# EAGLE schematic untitled (EAGLE 9.6.2)
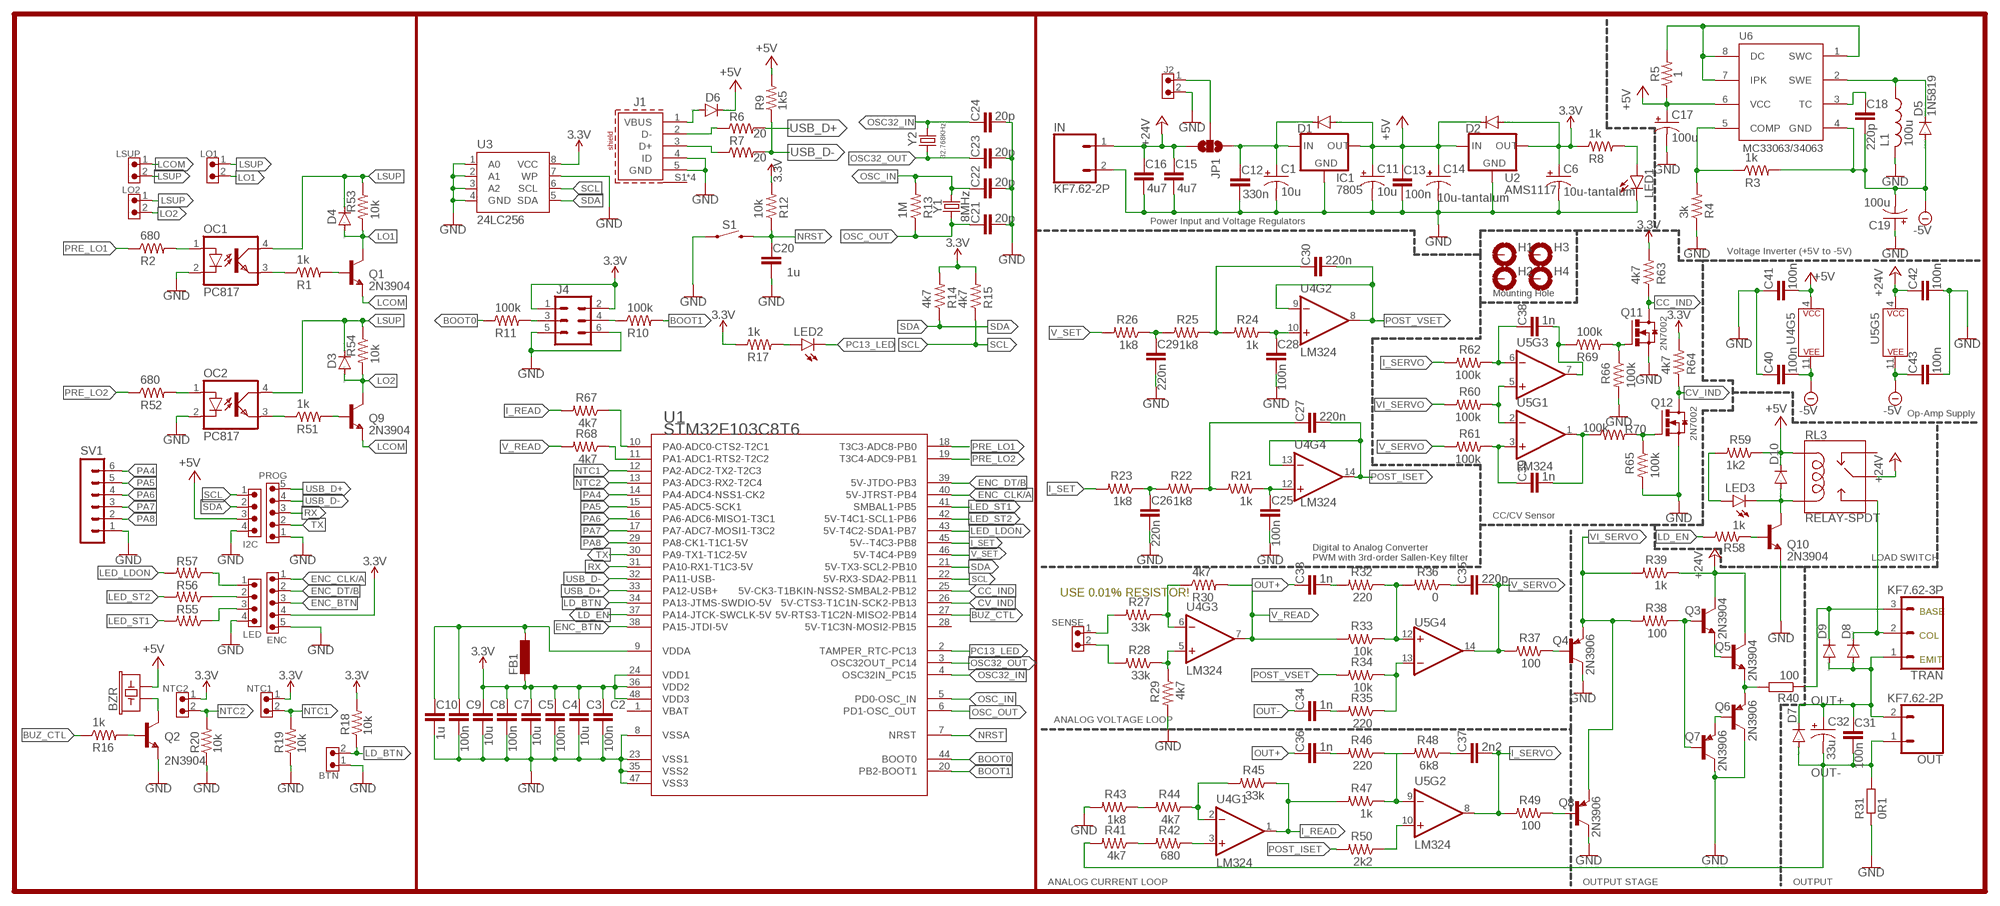
[diagram p0: schematic, sheet 1]

## Parts
BTN  61900211121  [61900211121]
BZR  BUZZER-PTH_KIT  [BUZZER-12MM-KIT]
C1  10u  CPOL-USE2.5-6  [E2,5-6]
C2  100n  C-EUC0805  [C0805]
C3  10u  C-EUC0805  [C0805]
C4  100n  C-EUC0805  [C0805]
C5  10u  C-EUC0805  [C0805]
C6  10u-tantalum  CPOL-USCT3528  [CT3528]
C7  100n  C-EUC0805  [C0805]
C8  10u  C-EUC0805  [C0805]
C9  100n  C-EUC0805  [C0805]
C10  1u  C-EUC0805  [C0805]
C11  10u  CPOL-USE2.5-6  [E2,5-6]
C12  330n  C-EUC0805  [C0805]
C13  100n  C-EUC0805  [C0805]
C14  10u-tantalum  CPOL-USCT3528  [CT3528]
C15  4u7  C-EUC0805  [C0805]
C16  4u7  C-EUC0805  [C0805]
C17  100u  CPOL-USE2.5-6  [E2,5-6]
C18  220p  C-EUC0805  [C0805]
C19  100u  CPOL-USE2.5-6  [E2,5-6]
C20  1u  C-EUC0805  [C0805]
C21  20p  C-EUC0805  [C0805]
C22  20p  C-EUC0805  [C0805]
C23  20p  C-EUC0805  [C0805]
C24  20p  C-EUC0805  [C0805]
C25  100n  C-EUC0805  [C0805]
C26  220n  C-EUC0805  [C0805]
C27  220n  C-EUC0805  [C0805]
C28  100n  C-EUC0805  [C0805]
C29  220n  C-EUC0805  [C0805]
C30  220n  C-EUC0805  [C0805]
C31  100n  C-EUC0805  [C0805]
C32  33u  CPOL-USD/7343-31R  [D/7343-31R]
C33  1n  C-EUC0805  [C0805]
C34  1n  C-EUC0805  [C0805]
C35  220p  C-EUC0805  [C0805]
C36  1n  C-EUC0805  [C0805]
C37  2n2  C-EUC0805  [C0805]
C38  1n  C-EUC0805  [C0805]
C39  1n  C-EUC0805  [C0805]
C40  100n  C-EUC0805  [C0805]
C41  100n  C-EUC0805  [C0805]
C42  100n  C-EUC0805  [C0805]
C43  100n  C-EUC0805  [C0805]
D1  DIODE-DO-214AC  [DO-214AC]
D2  DIODE-DO-214AC  [DO-214AC]
D3  DIODE-DO-214AC  [DO-214AC]
D4  DIODE-DO-214AC  [DO-214AC]
D5  1N5819  DIODE-DO-214AC  [DO-214AC]
D6  DIODE-DO-214AC  [DO-214AC]
D7  DIODE-DO-214AC  [DO-214AC]
D8  DIODE-DO-214AC  [DO-214AC]
D9  DIODE-DO-214AC  [DO-214AC]
D10  DIODE-DO-214AC  [DO-214AC]
ENC  61900511121  61900511121  [61900511121]
FB1  L-EUL1812  [L1812]
H1  MOUNT-PAD-ROUND3.2  [3,2-PAD]
H2  MOUNT-PAD-ROUND3.2  [3,2-PAD]
H3  MOUNT-PAD-ROUND3.2  [3,2-PAD]
H4  MOUNT-PAD-ROUND3.2  [3,2-PAD]
I2C  61900411121  61900411121  [61900411121]
IC1  7805  78XXS  [78XXS]
IN  KF7.62-2P  [KF7.62]
J1  629105136821  [629105136821]
J2  61900211121  [61900211121]
J4  FEMALE 2x3  CONN_03X2FEMALE  [2X3]
JP1  JUMPER-SMT_3_NO_NO-SILK  [SMT-JUMPER_3_NO_NO-SILK]
L1  100u  L-US6000-XXX-RC  [6000-XXXX-RC]
LED  61900411121  61900411121  [61900411121]
LED1  LEDCHIP-LED0805  [CHIP-LED0805]
LED2  LEDCHIP-LED0805  [CHIP-LED0805]
LED3  LEDCHIP-LED0805  [CHIP-LED0805]
LO1  61900211121  [61900211121]
LO2  61900211121  [61900211121]
LSUP  61900211121  [61900211121]
NTC1  61900211121  [61900211121]
NTC2  61900211121  [61900211121]
OC1  PC817  [DIL04]
OC2  PC817  [DIL04]
OUT  KF7.62-2P  [KF7.62]
PROG  61900511121  61900511121  [61900511121]
Q1  2N3904  [TO92]
Q2  2N3904  [TO92]
Q3  2N3904  [TO92]
Q4  2N3906  [TO92]
Q5  2N3904  [TO92]
Q6  2N3906  [TO92]
Q7  2N3906  [TO92]
Q8  2N3906  [TO92]
Q9  2N3904  [TO92]
Q10  2N3904  [TO92]
Q11  2N7002  2N7002,215  [SOT23-3]
Q12  2N7002  2N7002,215  [SOT23-3]
R1  1k  R-US_M0805  [M0805]
R2  680  R-US_M0805  [M0805]
R3  1k  R-US_M0805  [M0805]
R4  3k  R-US_M0805  [M0805]
R5  1  0.11OHM-2010-1/2W-1%  [2010]
R6  20  R-US_M0805  [M0805]
R7  20  R-US_M0805  [M0805]
R8  1k  R-US_M0805  [M0805]
R9  1k5  R-US_M0805  [M0805]
R10  100k  R-US_M0805  [M0805]
R11  100k  R-US_M0805  [M0805]
R12  10k  R-US_M0805  [M0805]
R13  1M  R-US_M0805  [M0805]
R14  4k7  R-US_M0805  [M0805]
R15  4k7  R-US_M0805  [M0805]
R16  1k  R-US_M0805  [M0805]
R17  1k  R-US_M0805  [M0805]
R18  10k  R-US_M0805  [M0805]
R19  10k  R-US_M0805  [M0805]
R20  10k  R-US_M0805  [M0805]
R21  1k  R-US_M0805  [M0805]
R22  1k8  R-US_M0805  [M0805]
R23  1k8  R-US_M0805  [M0805]
R24  1k  R-US_M0805  [M0805]
R25  1k8  R-US_M0805  [M0805]
R26  1k8  R-US_M0805  [M0805]
R27  33k  R-US_M0805  [M0805]
R28  33k  R-US_M0805  [M0805]
R29  4k7  R-US_M0805  [M0805]
R30  4k7  R-US_M0805  [M0805]
R31  0R1  R-EU_0922/22  [0922/22]
R32  220  R-US_M0805  [M0805]
R33  10k  R-US_M0805  [M0805]
R34  10k  R-US_M0805  [M0805]
R35  220  R-US_M0805  [M0805]
R36  0  R-US_M0805  [M0805]
R37  100  R-US_M0805  [M0805]
R38  100  R-US_M0805  [M0805]
R39  1k  R-US_M0805  [M0805]
R40  100  R-EU_0922/22  [0922/22]
R41  4k7  R-US_M0805  [M0805]
R42  680  R-US_M0805  [M0805]
R43  1k8  R-US_M0805  [M0805]
R44  4k7  R-US_M0805  [M0805]
R45  33k  R-US_M0805  [M0805]
R46  220  R-US_M0805  [M0805]
R47  1k  R-US_M0805  [M0805]
R48  6k8  R-US_M0805  [M0805]
R49  100  R-US_M0805  [M0805]
R50  2k2  R-US_M0805  [M0805]
R51  1k  R-US_M0805  [M0805]
R52  680  R-US_M0805  [M0805]
R53  10k  R-US_M0805  [M0805]
R54  10k  R-US_M0805  [M0805]
R55  680  R-US_M0805  [M0805]
R56  680  R-US_M0805  [M0805]
R57  680  R-US_M0805  [M0805]
R58  1k  R-US_M0805  [M0805]
R59  1k2  R-US_M0805  [M0805]
R60  100k  R-US_M0805  [M0805]
R61  100k  R-US_M0805  [M0805]
R62  100k  R-US_M0805  [M0805]
R63  4k7  R-US_M0805  [M0805]
R64  4k7  R-US_M0805  [M0805]
R65  100k  R-US_M0805  [M0805]
R66  100k  R-US_M0805  [M0805]
R67  4k7  R-US_M0805  [M0805]
R68  4k7  R-US_M0805  [M0805]
R69  100k  R-US_M0805  [M0805]
R70  100k  R-US_M0805  [M0805]
RL3  RELAY-SPDT  [RELAY_G5LE]
S1  MOMENTARY-SWITCH-SPST-SMD-6.2MM-TALL  [TACTILE_SWITCH_SMD_6.2MM_TALL]
SENSE  61900211121  [61900211121]
SV1  MA06-1  [MA06-1]
TRAN  KF7.62-3P  [KF7.62-3P]
U1  STM32F103C8T6  [TQFP48]
U2  AMS1117  [SOT89R]
U3  24LC256  EEPROM-I2C256K  [SO08]
U4  LM324  LMV324  [SO14]
U5  LM324  LMV324  [SO14]
U6  34063  MC33063/MC34063D  [SO08]
Y1  8MHz  CRYSTALPTH-HC49US  [HC49US]
Y2  32.768KHz  MC-306  [MC-306]

## Nets
3.3V: C2.1 C3.1 C4.1 C5.1 C6.+ C7.1 C8.1 D2.A ENC.4 FB1.2 J4.1 J4.2 NTC1.1 NTC2.1 R8.1 R12.2 R14.2 R15.2 R17.1 R18.2 R63.2 R64.2 U1.24(VDD1) U1.36(VDD2) U1.48(VDD3) U2.3(OUT) U2.4(OUT) U3.8(VCC)
+5V: BZR.- C11.+ C13.1 C14.+ C17.+ C41.2 D1.A D2.C D6.C D10.C I2C.3 IC1.OUT R5.1 R9.2 R59.1 RL3.2(COIL1) U2.1(IN) U4.4(P$V+) U6.6(VCC)
+24V: C15.1 C16.1 C42.1 IN.1 JP1.3 Q3.1(C) Q5.1(C) R39.1 RL3.1(MAIN) U5.4(P$V+)
-5V: C18.2 C19.- C40.2 C43.1 D5.A R3.2 U4.11(P$V-) U5.11(P$V-) U6.4(GND)
BASE: D9.C R40.1 TRAN.3
BOOT0: R11.1 U1.44(BOOT0)
BOOT1: R10.2 U1.20(PB2-BOOT1)
BUZ_CTL: R16.1 U1.27(5V-RTS3-T1C2N-MISO2-PB14)
CC_IND: Q11.3(D) R63.1 U1.25(5V-CK3-T1BKIN-NSS2-SMBAL2-PB12)
COL: D8.C RL3.3(NO) TRAN.2
CV_IND: Q12.3(D) R64.1 U1.26(5V-CTS3-T1C1N-SCK2-PB13)
ENC_BTN: ENC.3 U1.38(PA15-JTDI-5V)
ENC_CLK/A: ENC.1 U1.40(5V-JTRST-PB4)
ENC_DT/B: ENC.2 U1.39(5V-JTDO-PB3)
GND: BTN.1 C1.- C2.2 C3.2 C4.2 C5.2 C6.- C7.2 C8.2 C9.2 C10.2 C11.- C12.2 C13.2 C14.- C15.2 C16.2 C17.- C19.+ C20.2 C21.2 C22.2 C23.2 C24.2 C25.2 C26.2 C28.2 C29.2 C40.1 C41.1 C42.2 C43.2 ENC.5 I2C.4 IC1.GND IN.2 J1.4(ID) J1.5(GND) J2.2 J4.5 J4.6 L1.2 LED1.C LED.4 OC1.2(C) OC2.2(C) PROG.1 Q2.3(E) Q4.1(C) Q6.1(C) Q7.1(C) Q8.1(C) Q10.3(E) Q11.2(S) Q12.2(S) R4.1 R19.1 R20.1 R29.2 R31.1 R43.2 R65.2 R66.2 S1.A2 SV1.1 U1.8(VSSA) U1.23(VSS1) U1.35(VSS2) U1.47(VSS3) U2.2(GND) U3.1(A0) U3.2(A1) U3.3(A2) U3.4(GND) U3.7(WP)
I_READ: R45.1 R47.2 R67.2 U4.1(OUT)
I_SERVO: C37.2 R49.2 R62.2 U5.8(OUT)
I_SET: R23.2 U1.45(5V--T4C3-PB8)
LCOM: LSUP.1 Q1.3(E) Q9.3(E)
LD_BTN: BTN.2 R18.1 U1.34(PA13-JTMS-SWDIO-5V)
LD_EN: R58.2 U1.37(PA14-JTCK-SWCLK-5V)
LED_LDON: R57.2 U1.43(5V-T4C2-SDA1-PB7)
LED_ST1: R55.2 U1.41(SMBAL1-PB5)
LED_ST2: R56.2 U1.42(5V-T4C1-SCL1-PB6)
LO1: D4.A LO1.2 Q1.1(C) R53.2
LO2: D3.A LO2.2 Q9.1(C) R54.2
LSUP: D3.C D4.C LO1.1 LO2.1 LSUP.2 OC1.4(COL) OC2.4(COL) R53.1 R54.1
N$1: C1.+ C12.1 D1.C IC1.IN JP1.1
N$2: Q1.2(B) R1.2
N$3: J2.1 JP1.2
N$4: LED1.A R8.2
N$5: OC1.3(EMIT) R1.1
N$6: D6.A J1.1(VBUS)
N$7: Q9.2(B) R51.2
N$8: OC2.3(EMIT) R51.1
N$9: OC2.1(A) R52.2
N$10: OC1.1(A) R2.2
N$11: C9.1 C10.1 FB1.1 U1.9(VDDA)
N$12: C18.1 U6.3(TC)
N$14: D5.C L1.1 U6.2(SWE)
N$15: R5.2 U6.1(SWC) U6.7(IPK) U6.8(DC)
N$16: J1.3(D+) R7.1
N$17: R3.1 R4.2 U6.5(COMP)
N$18: J1.2(D-) R6.1
N$19: J4.3 R11.2
N$20: J4.4 R10.1
N$21: Q2.2(B) R16.2
N$22: LED2.A R17.2
N$23: BZR.+ Q2.1(C)
N$24: C28.1 R24.1 U4.10(+IN)
N$25: C29.1 R25.2 R26.1
N$26: C30.1 R24.2 R25.1
N$27: Q3.2(B) Q7.2(B) R38.1
N$28: R27.1 R30.1 U4.6(-IN)
N$29: R28.1 R29.1 U4.5(+IN)
N$30: C25.1 R21.1 U4.12(+IN)
N$31: C27.1 R21.2 R22.1
N$32: C26.1 R22.2 R23.1
N$33: Q6.2(B) Q7.3(E)
N$34: R68.1 U1.11(PA1-ADC1-RTS2-T2C2)
N$35: R32.1 R33.1 R36.2 U5.12(+IN)
N$36: LED.1 R57.1
N$37: C33.2 R32.2
N$38: Q5.3(E) Q6.3(E) R40.2
N$39: Q3.3(E) Q5.2(B)
N$40: C35.1 R36.1
N$41: R67.1 U1.10(PA0-ADC0-CTS2-T2C1)
N$42: C34.2 R35.2
N$43: R34.1 R35.1 U5.13(-IN)
N$44: Q4.2(B) R37.1
N$45: Q12.1(G) R65.1 R70.2
N$46: R41.1 R42.2
N$47: R42.1 U4.3(+IN)
N$48: R44.1 R45.2 U4.2(-IN)
N$49: R43.1 R44.2
N$50: Q11.1(G) R66.1 R69.2
N$51: C38.2 R69.1 U5.7(OUT)
N$52: C36.2 R46.2
N$53: R46.1 R47.1 R48.2 U5.9(-IN)
N$54: C37.1 R48.1
N$56: R50.1 U5.10(+IN)
N$57: Q8.2(B) R49.1
N$58: LED.2 R56.1
N$59: LED.3 R55.1
N$61: D10.A LED3.C Q10.1(C) RL3.5(COIL2)
N$62: R60.1 U5.2(-IN) U5.5(+IN)
N$64: Q10.2(B) R58.1
N$65: LED3.A R59.2
N$66: C39.1 R61.1 U5.3(+IN)
N$67: C39.2 R70.1 U5.1(OUT)
N$69: C38.1 R62.1 U5.6(-IN)
NRST: C20.1 R12.1 S1.B2 U1.7(NRST)
NTC1: NTC1.2 R19.2 U1.12(PA2-ADC2-TX2-T2C3)
NTC2: NTC2.2 R20.2 U1.13(PA3-ADC3-RX2-T2C4)
OSC32_IN: C24.1 U1.4(OSC32IN_PC15) Y2.4
OSC32_OUT: C23.1 U1.3(OSC32OUT_PC14) Y2.1
OSC_IN: C22.1 R13.2 U1.5(PD0-OSC_IN) Y1.2
OSC_OUT: C21.1 R13.1 U1.6(PD1-OSC_OUT) Y1.1
OUT+: C31.1 C32.+ C33.1 C36.1 D7.C D8.A D9.A OUT.2 TRAN.1
OUT-: C31.2 C32.- C34.1 D7.A OUT.1 R31.2 R41.2
PA4: SV1.6 U1.14(PA4-ADC4-NSS1-CK2)
PA5: SV1.5 U1.15(PA5-ADC5-SCK1)
PA6: SV1.4 U1.16(PA6-ADC6-MISO1-T3C1)
PA7: SV1.3 U1.17(PA7-ADC7-MOSI1-T3C2)
PA8: SV1.2 U1.29(PA8-CK1-T1C1-5V)
PC13_LED: LED2.C U1.2(TAMPER_RTC-PC13)
POST_ISET: C27.2 R50.2 U4.13(-IN) U4.14(OUT)
POST_VSET: C30.2 R34.2 U4.8(OUT) U4.9(-IN)
PRE_LO1: R2.1 U1.18(T3C3-ADC8-PB0)
PRE_LO2: R52.1 U1.19(T3C4-ADC9-PB1)
RX: PROG.3 U1.31(PA10-RX1-T1C3-5V)
SCL: I2C.1 R15.1 U1.22(5V-RX3-SDA2-PB11) U3.6(SCL)
SDA: I2C.2 R14.1 U1.21(5V-TX3-SCL2-PB10) U3.5(SDA)
SENSE+: R28.2 SENSE.2
SENSE-: R27.2 SENSE.1
TX: PROG.2 U1.30(PA9-TX1-T1C2-5V)
USB_D+: PROG.5 R6.2 U1.33(PA12-USB+)
USB_D-: PROG.4 R7.2 R9.1 U1.32(PA11-USB-)
V_READ: R30.2 R33.2 R68.2 U4.7(OUT)
V_SERVO: C35.2 R37.2 R61.2 U5.14(OUT)
V_SET: R26.2 U1.46(5V-T4C4-PB9)
VI_SERVO: Q4.3(E) Q8.3(E) R38.2 R39.2 R60.2
Unconnected: H1.B3,2(MOUNT) H2.B3,2(MOUNT) H3.B3,2(MOUNT) H4.B3,2(MOUNT) J1.S1(SHIELD) J1.S2(SHIELD) J1.S3(SHIELD) J1.S4(SHIELD) RL3.4(NC) U1.28(5V-T1C3N-MOSI2-PB15)

## Notes on the sheet
- Power Input and Voltage Regulators
- Voltage Inverter (+5V to -5V)
- Mounting Hole
- Op-Amp Supply
- CC/CV Sensor
- Digital to Analog Converter
  PWM with 3rd-order Sallen-Key filter
- LOAD SWITCH
- USE 0.01% RESISTOR!
- BASE
- COL
- EMIT
- ANALOG VOLTAGE LOOP
- ANALOG CURRENT LOOP | OUTPUT STAGE | OUTPUT

## Power pins joined to a net without a drawn wire
VBAT: U1.1(VBAT)

## Library data of the parts
BTN J2 LO1 LO2 LSUP NTC1 NTC2 SENSE = Wurth_Connectors_WR-WTB:61900211121: WR-WTB 2.54 mm Male Locking Header KIND PROPERTIES: Pitch:2.54 mm Gender:Male MATERIAL PROPERTIES: Insulator Material :PA66 Insulator Flammability Rating:UL94 V-0 Insulator Color:Beige Contact Material:Copper Alloy Contact Plating:Tin Contact Type:Stamped GENERAL INFORMATION Operating Temperature:-40 up to +105 °C Compliance: RoHS Working Voltage:250 V (AC) Withstanding Voltage:1000 V (AC) Contact Resistance:20 mΩ RISO:1000 MΩ CERTIFICATION UL Approval:E323964 PACKAGING PROPERTIES Packaging:Bag <https://katalog.we-online.com/media/images/v2/o33345v209%20Family_WR-WTB_6190xx11121.jpg> Details see: https://katalog.we-online.com/en/em/WTB_2_54_MALE_LOCKING_HEADER_6190XX11121 Updated by Ella Wu 2020-07-08 2020 (C) Würth Elektronik; CONTACT-RESISTANCE: 20mOhm; DATASHEET-URL: https://www.we-online.com/catalog/datasheet/61900211121.pdf; GENDER: Male; L: 5.08mm; MOUNT: THT; PACKAGING: Bag; PART-NUMBER: 61900211121; PCB-CABLE-PANEL: PCB; PINS: 2; PITCH: 2.54mm; TOL-R: max.; TYPE: Vertical; USE-WITH: WR-WTB 2.54 mm Female Terminal Housing; VALUE: 61900211121; WORKING-VOLTAGE: 250V(AC)
BZR = SparkFun-Electromechanical:BUZZER: Buzzer Small round buzzers that operate around the audible 2kHz range. You can use these as speakers to create simple music or user interfaces. Variant Overview: PTH - Mini Speaker - PC Mount 12mm 2.048kHz <https://www.sparkfun.com/products/7950> PTH_KIT - Mini Speaker - PC Mount 12mm 2.048kHz <https://www.sparkfun.com/products/7950> KIT simplifies soldering by adding stop mask to one side of the pads. PTH_NO_SILK - Mini Speaker - PC Mount 12mm 2.048kHz <https://www.sparkfun.com/products/7950> No silkscreen indicator of buzzer outline. PTH_KIT_NO_SILK - Mini Speaker - PC Mount 12mm 2.048kHz <https://www.sparkfun.com/products/7950> KIT package w/o silkscreen SMD - Buzzer Audio Magnetic (CCV-084B16) SMD buzzer used on, e.g. the LilyPad Buzzer <https://www.sparkfun.com/products/8463> and RFID USB Reader <https://www.sparkfun.com/products/9963>. SMD_KIT - Buzzer Audio Magnetic (CCV-084B16) SMD Buzzer with elongated pins to make soldering easier. Used on the SparkFun Simon Says - Surface Mount Soldering Kit <https://www.sparkfun.com/products/10935>.; PROD_ID: COMP-08253; SF_SKU: COM-07950
C1 C6 C11 C14 C17 C19 C32 = rcl:CPOL-US: POLARIZED CAPACITOR, American symbol; SPICEPREFIX: C
C2-C5 C7-C10 C12 C13 C15 C16 C18 C20-C31 C33-C43 = rcl:C-EU: CAPACITOR, European symbol; SPICEPREFIX: C
D1-D10 = diode:DIODE-: DIODE
ENC PROG = Wurth_Connectors_WR-WTB:61900511121: WR-WTB 2.54 mm Male Locking Header KIND PROPERTIES: Pitch:2.54 mm Gender:Male MATERIAL PROPERTIES: Insulator Material :PA66 Insulator Flammability Rating:UL94 V-0 Insulator Color:Beige Contact Material:Copper Alloy Contact Plating:Tin Contact Type:Stamped GENERAL INFORMATION Operating Temperature:-40 up to +105 °C Compliance: RoHS Working Voltage:250 V (AC) Withstanding Voltage:1000 V (AC) Contact Resistance:20 mΩ RISO:1000 MΩ CERTIFICATION UL Approval:E323964 PACKAGING PROPERTIES Packaging:Bag <https://katalog.we-online.com/media/images/v2/o33345v209%20Family_WR-WTB_6190xx11121.jpg> Details see: https://katalog.we-online.com/en/em/WTB_2_54_MALE_LOCKING_HEADER_6190XX11121 Updated by Ella Wu 2020-07-08 2020 (C) Würth Elektronik; CONTACT-RESISTANCE: 20mOhm; DATASHEET-URL: https://www.we-online.com/catalog/datasheet/61900511121.pdf; GENDER: Male; L: 12.7mm; MOUNT: THT; PACKAGING: Bag; PART-NUMBER: 61900511121; PCB-CABLE-PANEL: PCB; PINS: 5; PITCH: 2.54mm; TOL-R: max.; TYPE: Vertical; USE-WITH: WR-WTB 2.54 mm Female Terminal Housing; WORKING-VOLTAGE: 250V(AC)
FB1 = rcl:L-EU: INDUCTOR, European symbol; SPICEPREFIX: L
H1-H4 = holes:MOUNT-PAD-ROUND: MOUNTING PAD, round
I2C LED = Wurth_Connectors_WR-WTB:61900411121: WR-WTB 2.54 mm Male Locking Header KIND PROPERTIES: Pitch:2.54 mm Gender:Male MATERIAL PROPERTIES: Insulator Material :PA66 Insulator Flammability Rating:UL94 V-0 Insulator Color:Beige Contact Material:Copper Alloy Contact Plating:Tin Contact Type:Stamped GENERAL INFORMATION Operating Temperature:-40 up to +105 °C Compliance: RoHS Working Voltage:250 V (AC) Withstanding Voltage:1000 V (AC) Contact Resistance:20 mΩ RISO:1000 MΩ CERTIFICATION UL Approval:E323964 PACKAGING PROPERTIES Packaging:Bag <https://katalog.we-online.com/media/images/v2/o33345v209%20Family_WR-WTB_6190xx11121.jpg> Details see: https://katalog.we-online.com/en/em/WTB_2_54_MALE_LOCKING_HEADER_6190XX11121 Updated by Ella Wu 2020-07-08 2020 (C) Würth Elektronik; CONTACT-RESISTANCE: 20mOhm; DATASHEET-URL: https://www.we-online.com/catalog/datasheet/61900411121.pdf; GENDER: Male; L: 10.16mm; MOUNT: THT; PACKAGING: Bag; PART-NUMBER: 61900411121; PCB-CABLE-PANEL: PCB; PINS: 4; PITCH: 2.54mm; TOL-R: max.; TYPE: Vertical; USE-WITH: WR-WTB 2.54 mm Female Terminal Housing; WORKING-VOLTAGE: 250V(AC)
IC1 = v-reg:78XXS: VOLTAGE REGULATOR
IN OUT = SparkFun-Connectors:KF7.62-2P
J1 = Wurth_Connectors_WR-USB:629105136821: WR-COM Micro USB 2.0 SMT Type B Horizontal 5 Contacts Kind Properties Durability:10 000 Mating cycles Quality Class:10 000 Mating cycles Connector Type:Micro USB Gender:Receptacle Type:Horizontal General Information Operating Temperature:-40up to +105 °C Compliance:RoHS Electrical Properties IR 1:1A Working Voltage:30V (AC) Withstanding Voltage:100V (AC) Contact Resistance:30 mΩ Material Properties Insulator Material:LCP Insulator Flammability Rating:UL94 V-0 Color:Black Contact Material:Copper Alloy Contact Plating: Gold Contact Type:Stamped Shielding Material:Stainless Steel Shielding Plating:Nickel <https://www.we-online.com/catalog/media/o32999v209%20Family_WR-COM_629105136821.jpg> Details see: https://www.we-online.com/catalog/en/COM_MICRO_SMT_TYPE_B_HORIZONTAL/ Updated by Yingchun, Shan 2020-01-16 2020 (C) Würth Elektronik; APPLICATION: Micro USB 2.0; DATASHEET-URL: https://www.we-online.com/catalog/datasheet/629105136821.pdf; GERDER: Receptacle; INTERFACE-TYPE: Type B; IR1: 1.0A; MOUNT: SMT; PACKAGING: Tape and Reel; PART-NUMBER: 629105136821; PINS: 5; TYPE: Horizontal; WORKING-VOLTAGE: 30V(AC)
J4 = SparkFun-Connectors:CONN_03X2: Multi connection point. Often used as Generic Header-pin footprint for 0.1 inch spaced/style header connections You can populate with any combo of single row headers, but if you'd like an exact match, check these: Header - 2x3 (Male, 0.1") <https://www.sparkfun.com/products/12807> (PRT-12807) Header - 2x3 (Female, 0.1") <https://www.sparkfun.com/products/13010> (PRT-13010) 2x3 Pin Shrouded Header <https://www.sparkfun.com/products/10877> (PRT-10877) On any of the 0.1 inch spaced packages, you can populate with these: Break Away Headers - Straight <https://www.sparkfun.com/products/116> (PRT-00116) Break Away Male Headers - Right Angle <https://www.sparkfun.com/products/553> (PRT-00553) Female Headers <https://www.sparkfun.com/products/115> (PRT-00115) Break Away Headers - Machine Pin <https://www.sparkfun.com/products/117> (PRT-00117) Break Away Female Headers - Swiss Machine Pin <https://www.sparkfun.com/products/743> (PRT-00743) Special note: the shrouded connector mates well with our 3x2 ribbon cables: Ribbon Crimp Connector - 6-pin (2x3, Female) <https://www.sparkfun.com/products/10651> (PRT-10651) Ribbon Cable - 6 wire (15ft) <https://www.sparkfun.com/products/10646> (PRT-10646); PROD_ID: CONN-11566
JP1 = SparkFun-Jumpers:JUMPER-SMT_3_NO: Normally open jumper This jumper has three pads in close proximity to each other. Apply solder to close the connection(s).
L1 = rcl:L-US: INDUCTOR, American symbol; SPICEPREFIX: L
LED1-LED3 = led:LED: LED OSRAM: - CHIPLED LG R971, LG N971, LY N971, LG Q971, LY Q971, LO R971, LY R971 LH N974, LH R974 LS Q976, LO Q976, LY Q976 LO Q996 - Hyper CHIPLED LW Q18S LB Q993, LB Q99A, LB R99A - SideLED LS A670, LO A670, LY A670, LG A670, LP A670 LB A673, LV A673, LT A673, LW A673 LH A674 LY A675 LS A676, LA A676, LO A676, LY A676, LW A676 LS A679, LY A679, LG A679 - Hyper Micro SIDELED® LS Y876, LA Y876, LO Y876, LY Y876 LT Y87S - SmartLED LW L88C, LW L88S LB L89C, LB L89S, LG L890 LS L89K, LO L89K, LY L89K LS L896, LA L896, LO L896, LY L896 - TOPLED LS T670, LO T670, LY T670, LG T670, LP T670 LSG T670, LSP T670, LSY T670, LOP T670, LYG T670 LG T671, LOG T671, LSG T671 LB T673, LV T673, LT T673, LW T673 LH T674 LS T676, LA T676, LO T676, LY T676, LB T676, LH T676, LSB T676, LW T676 LB T67C, LV T67C, LT T67C, LS T67K, LO T67K, LY T67K, LW E67C LS E67B, LA E67B, LO E67B, LY E67B, LB E67C, LV E67C, LT E67C LW T67C LS T679, LY T679, LG T679 LS T770, LO T770, LY T770, LG T770, LP T770 LB T773, LV T773, LT T773, LW T773 LH T774 LS E675, LA E675, LY E675, LS T675 LS T776, LA T776, LO T776, LY T776, LB T776 LHGB T686 LT T68C, LB T68C - Hyper Mini TOPLED® LB M676 - Mini TOPLED Santana® LG M470 LS M47K, LO M47K, LY M47K Source: http://www.osram.convergy.de LUXEON: - LUMILED® LXK2-PW12-R00, LXK2-PW12-S00, LXK2-PW14-U00, LXK2-PW14-V00 LXK2-PM12-R00, LXK2-PM12-S00, LXK2-PM14-U00 LXK2-PE12-Q00, LXK2-PE12-R00, LXK2-PE12-S00, LXK2-PE14-T00, LXK2-PE14-U00 LXK2-PB12-K00, LXK2-PB12-L00, LXK2-PB12-M00, LXK2-PB14-N00, LXK2-PB14-P00, LXK2-PB14-Q00 LXK2-PR12-L00, LXK2-PR12-M00, LXK2-PR14-Q00, LXK2-PR14-R00 LXK2-PD12-Q00, LXK2-PD12-R00, LXK2-PD12-S00 LXK2-PH12-R00, LXK2-PH12-S00 LXK2-PL12-P00, LXK2-PL12-Q00, LXK2-PL12-R00 Source: www.luxeon.com KINGBRIGHT: KA-3528ASYC Source: www.kingbright.com
OC1 OC2 = optocoupler:PC817: SHARP OPTO COUPLER; MPN: PC817X4J000F; OC_FARNELL: 9707727; OC_NEWARK: 97K7059
Q1-Q3 Q5 Q9 Q10 = transistor-npn:2N3904: NPN Transistor
Q4 Q6-Q8 = transistor-pnp:2N3906: PNP Transistor
Q11 Q12 = Transistor:2N7002,215: MOSFET N-CH 60V 300MA SOT-23 Manufacturer's datasheet <https://assets.nexperia.com/documents/data-sheet/2N7002.pdf>; CREATED_BY: PCBLayout.com; DIGIKEY_PART_NUMBER: 1727-2764-1-ND; MANUFACTURER: Nexperia USA Inc.; MPN: 2N7002,215; PACKAGE: SOT-23-3
R1-R4 R6-R30 R32-R39 R41-R70 = rcl:R-US_: RESISTOR, American symbol; SPICEPREFIX: R
R5 = SparkFun-Resistors:0.11OHM: 0.11Ω resistor A resistor is a passive two-terminal electrical component that implements electrical resistance as a circuit element. Resistors act to reduce current flow, and, at the same time, act to lower voltage levels within circuits. - Wikipedia; PROD_ID: RES-08354; VALUE: 0.11
R31 R40 = rcl:R-EU_: RESISTOR, European symbol; SPICEPREFIX: R
RL3 = SparkFun-Electromechanical:RELAY-SPDT: SPDT Electromechanical Relay Single-pole, double-throw sealed relays. When current is applied to the coil, it throws a simple changeover switch, terminating the connection from the NC contact to ground and closing the NO contact. Use them to switch high voltage/high current devices. SparkFun Products JQX-15F: Relay SPDT Sealed - 20A <https://www.sparkfun.com/products/10924> (COM-10924) JZC-11F: Relay SPDT Sealed <https://www.sparkfun.com/products/100> (COM-00100); PROD_ID: COMP-14214
S1 = SparkFun-Switches:MOMENTARY-SWITCH-SPST: Momentary Switch (Pushbutton) - SPST Normally-open (NO) SPST momentary switches (buttons, pushbuttons). Variants PTH-12MM - 12mm square, through-hole Momentary Pushbutton Switch - 12mm Square <https://www.sparkfun.com/products/9190> (COM-09190) PTH-6.0MM, PTH-6.0MM-KIT - 6.0mm square, through-hole Mini Pushbutton Switch <https://www.sparkfun.com/products/97> (COM-00097) KIT package intended for soldering kit's - only one side of pads' copper is exposed. PTH-RIGHT-ANGLE-KIT - Right-angle, through-hole Right Angle Tactile Button <https://www.sparkfun.com/products/10791> - Used on SparkFun BigTime Watch Kit <https://www.sparkfun.com/products/11734> SMD-12MM - 12mm square, surface-mount Tactile Button - SMD (12mm) <https://www.sparkfun.com/products/12993> (COM-12993) Used on SparkFun PicoBoard <https://www.sparkfun.com/products/11888> SMD-4.5MM - 4.5mm Square Trackball Switch Used on SparkFun Blackberry Trackballer Breakout <https://www.sparkfun.com/products/13169> SMD-4.6MMX2.8MM - 4.60mm x 2.80mm, surface mount Used on SparkFun SAMD21 Mini Breakout <https://www.sparkfun.com/products/13664> SMD-5.2MM, SMD-5.2-REDUNDANT - 5.2mm square, surface-mount Mini Pushbutton Switch - SMD <https://www.sparkfun.com/products/8720> (COM-08720) Used on Arduino Pro Mini <https://www.sparkfun.com/products/11114> REDUNDANT package connects both switch circuits together SMD-6.0X3.5MM - 6.0 x 3.5mm, surface mount Momentary Reset Switch SMD <https://www.sparkfun.com/products/8229> (COM-08229) SMD-6.2MM-TALL - 6.2mm square, surface mount Tactile Button - SMD (6mm) <https://www.sparkfun.com/products/12992> Used on SparkFun Digital Sandbox <https://www.sparkfun.com/products/12651> SMD-RIGHT-ANGLE - Right-angle, surface mount Used on SparkFun Block for Intel® Edison - Arduino <https://www.sparkfun.com/products/13036>; PROD_ID: SWCH-11966; SF_SKU: COM-12992
SV1 = con-lstb:MA06-1: PIN HEADER; OC_FARNELL: unknown; OC_NEWARK: unknown
TRAN = SparkFun-Connectors:KF7.62-3P
U1 = stm32:STM32F103C8T6
U2 = v-reg:AMS1117
U3 = SparkFun-IC-Memory:EEPROM-I2C: I2C EEPROMs, 24LC256 and others 24LC256 Series 256 kb I2C 2 Wire (32 k x 8 Bit) 2.5 V Serial EEPROM SMD - SOIC-8 Datasheet SparkFun Products SparkFun UDB5 - PIC UAV Development Board <https://www.sparkfun.com/products/11703> (GPS-11703); PROD_ID: IC-09714
U4 U5 = SparkFun-IC-Amplifiers:LMV324: IC LMV324 Quad Op Amp Jellybean quad op-amp Datasheet <http://cdn.sparkfun.com/datasheets/Sensors/Sound/LMV324.pdf> SparkFun Products SparkFun Sensor Kit <https://www.sparkfun.com/products/13754> (DEV-13754) SparkFun Inventor's Kit for Arduino 101 <https://www.sparkfun.com/products/13844> (KIT-13844) SparkFun Sound Detector <https://www.sparkfun.com/products/12642> (SEN-12642); PROD_ID: IC-08227; VALUE: LMV324
U6 = adafruit:MC33063/MC34063: MC33063 and MC34063 Basic DC/DC converter with internal power-NPN transistor, 100KHz, 1.5A peak switch current. 3-40 input/output.
Y1 = SparkFun-Clocks:CRYSTAL: Crystals (Generic) These are passive quartz crystals, which can be used as a clock source for a microcontroller. Crystal's are two-terminal devices. They require external "load" capacitors to generate an oscillating signal.
Y2 = crystal:MC-306: kHz RANGE CRYSTAL UNIT SMD Source: MC-306_405_406_E07X.PDF Homepage <http://www.epsontoyocom.co.jp>; MPN: MC-306 60.0KHZ 100PPM ,12.5PF; OC_FARNELL: 1278040; OC_NEWARK: 31M5576